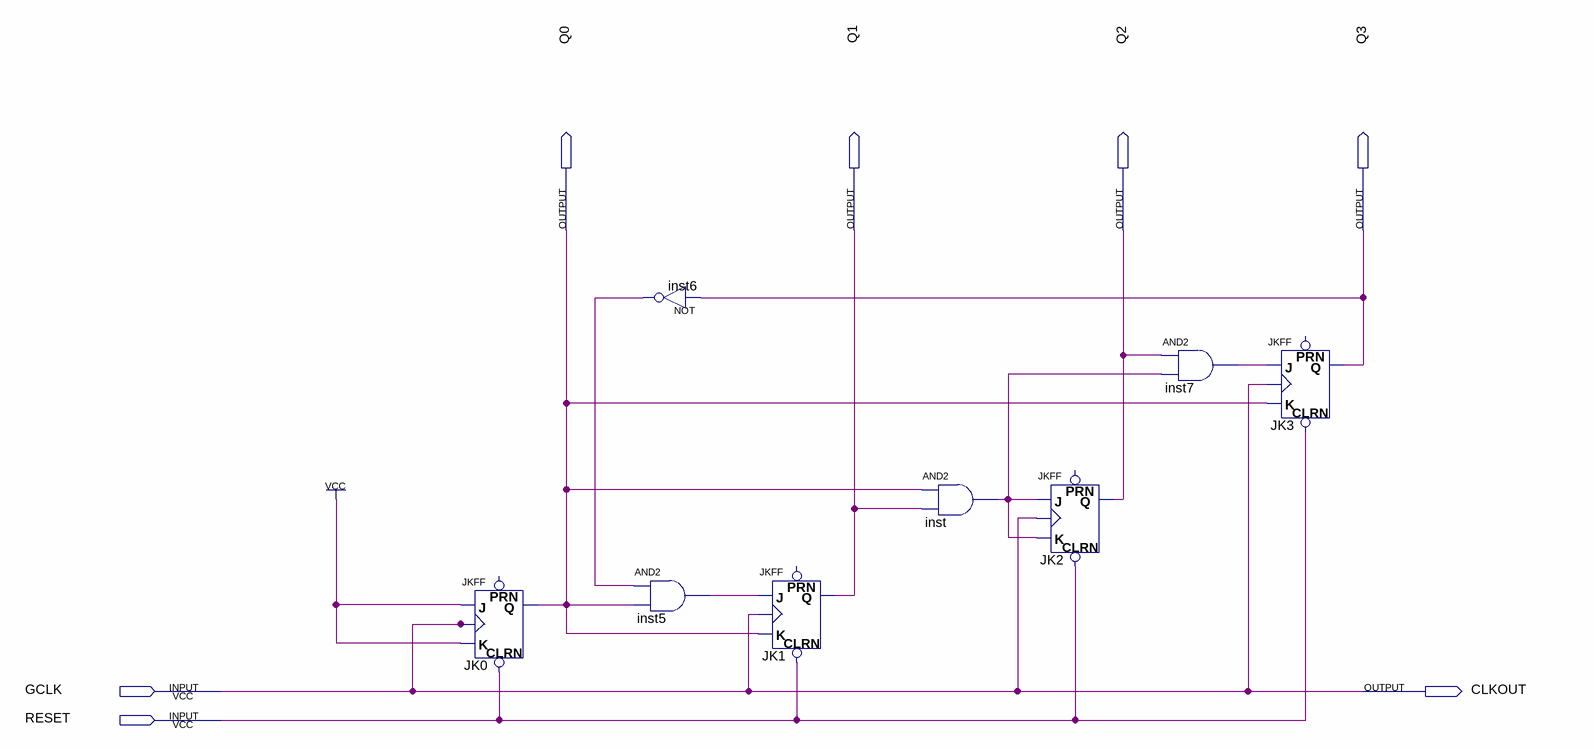
[diagram p0: schematic sheet]
// Quartus schematic lab2b.bdf as structural Verilog: 8 symbols, 7 pins
module lab2b (
  input  GCLK,
  input  RESET,
  output Q0,
  output Q1,
  output Q2,
  output Q3,
  output CLKOUT
);

  wire inst5_out, inst6_out, inst7_out, inst_out;

  JKFF JK0 (.CLRN(RESET), .K(1'b1), .J(1'b1), .CLK(GCLK), .Q(Q0));  // open: PRN
  not inst6 (inst6_out, Q3);
  and inst5 (inst5_out, inst6_out, Q0);
  JKFF JK1 (.CLRN(RESET), .K(Q0), .J(inst5_out), .CLK(GCLK), .Q(Q1));  // open: PRN
  and inst (inst_out, Q0, Q1);
  JKFF JK2 (.CLRN(RESET), .K(inst_out), .J(inst_out), .CLK(GCLK), .Q(Q2));  // open: PRN
  and inst7 (inst7_out, Q2, inst_out);
  JKFF JK3 (.CLRN(RESET), .K(Q0), .J(inst7_out), .CLK(GCLK), .Q(Q3));  // open: PRN

  assign CLKOUT = GCLK;
endmodule
